# Altium schematic sheet Sheet1.SchDoc
size A
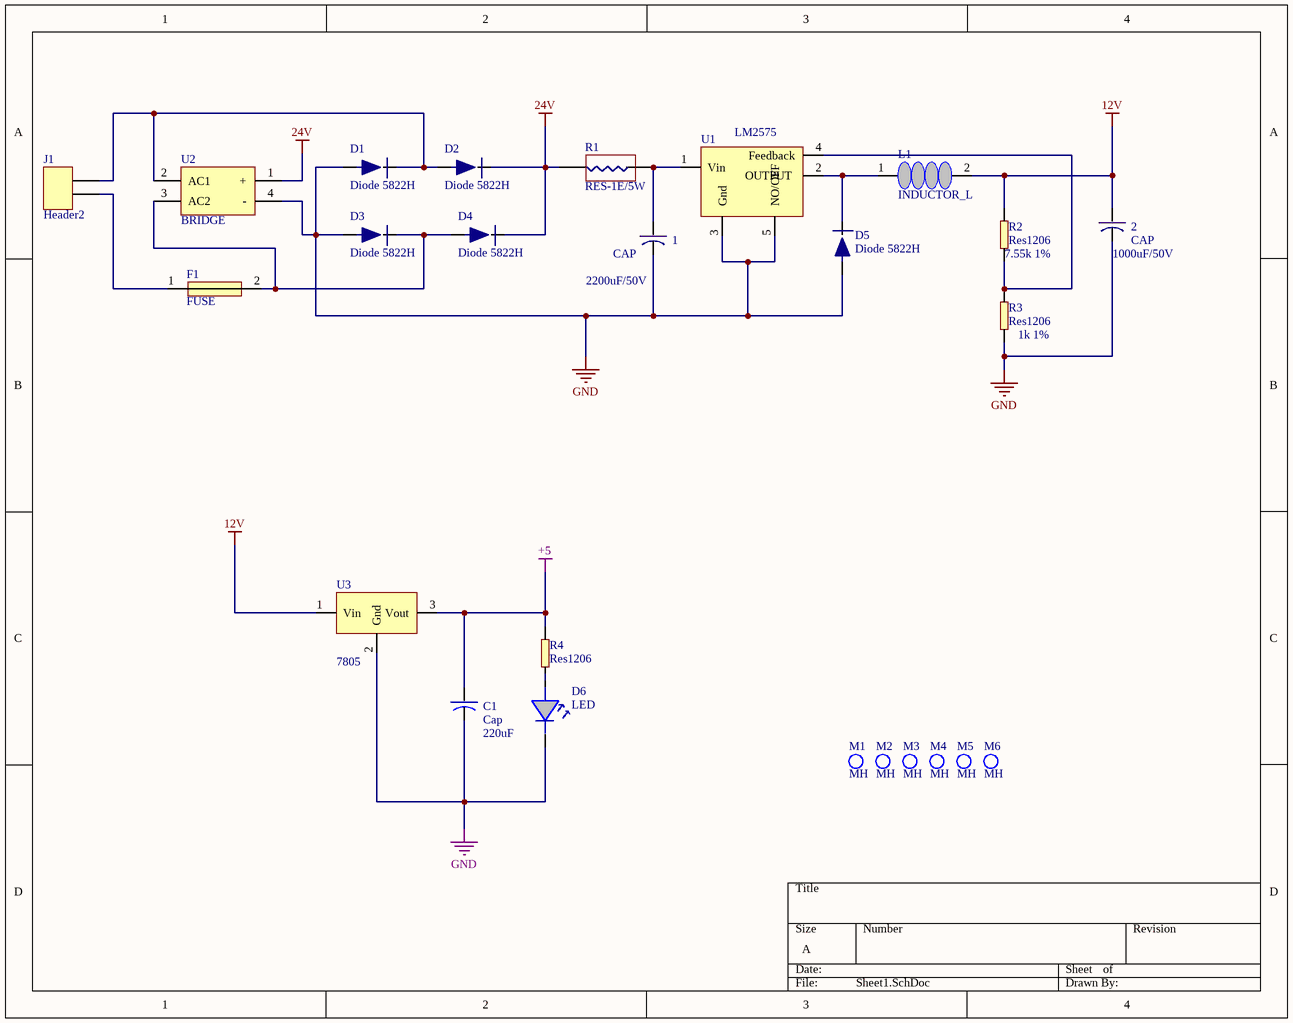
[diagram p0: Sheet1.SchDoc]

## Parts
1  CAP  value 2200uF/50V  [Capacitor - 2200uF]
2  CAP  value 1000uF/50V  [Capacitor1000uF]
C1  Cap  [CAP_220uF]
D1  Diode 5822H  [Diode]
D2  Diode 5822H  [Diode]
D3  Diode 5822H  [Diode]
D4  Diode 5822H  [Diode]
D5  Diode 5822H  [Diode]
D6  LED  [LED5MM]
F1  FUSE  [FUSE]
J1  Header2  [Header2]
L1  INDUCTOR_L  [inductor-200mil]
M1  MH  [Mounting hole]
M2  MH  [Mounting hole]
M3  MH  [Mounting hole]
M4  MH  [Mounting hole]
M5  MH  [Mounting hole]
M6  MH  [Mounting hole]
R1  RES-1E/5W  [RES-1E/5W]
R2  Res1206  value 7.55k 1%  [1206]
R3  Res1206  value 1k 1%  [1206]
R4  Res1206  [1206]
U1  LM2575  [D2PAK_5PIN]
U2  BRIDGE  [BRIDGE_200MIL]
U3  7805  [D-PAK]

## Nets
12V: 2.1(a) L1.2(b) R2.2(b) U3.1(Vin)
24V: D2.2 D4.2 R1.1 U2.1(+)
+5: C1.1(a) R4.2(b) U3.3(Vout)
GND: 1.2(b) 2.2(b) C1.2(b) D1.1 D3.1 D5.1 D6.2(B) R3.1(a) U1.3(Gnd) U1.5(NO/OFF) U2.4(-) U3.2(Gnd)
Net1_1: 1.1(a) R1.2 U1.1(Vin)
NetD1_2: D1.2 D2.1 J1.2 U2.2(AC1)
NetD3_2: D3.2 D4.1 F1.2(B) U2.3(AC2)
NetD5_2: D5.2 L1.1(a) U1.2(OUTPUT)
NetD6_1: D6.1(A) R4.1(a)
NetF1_1: F1.1(A) J1.1
NetR2_1: R2.1(a) R3.2(b) U1.4(Feedback)

## Notes on the sheet
- (in symbol CAP_220uF) 220uF

## Library data of the parts
1 2 = 2200uF/50V
C1 = CAP_220uF
D6 = LED_5MM
L1 = Inductor-200
U1 = LM2575: Vol Reg
U3 = 7805: Vol Reg